# Altium project 基于单片机的电子秤.PrjPCB
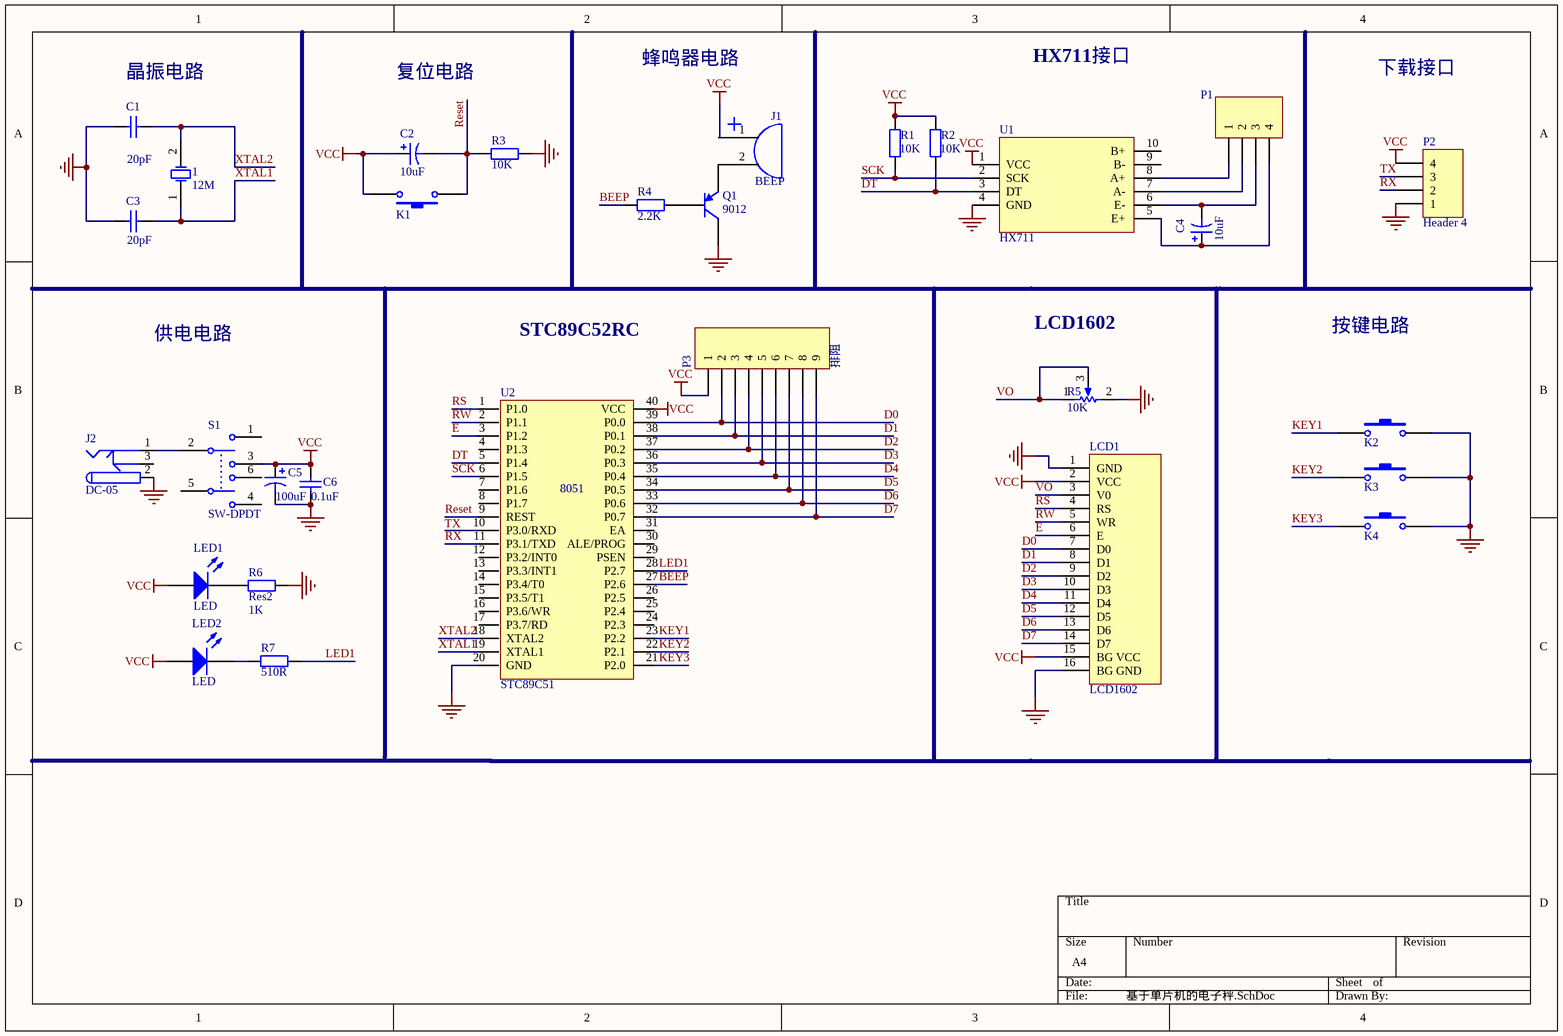
[diagram p0: 基于单片机的电子秤.SchDoc]
1 sheet, 30 parts. Net scope: global (net labels, ports and power ports of the same name join across sheets).
Board file: 基于单片机的电子秤.PcbDoc

## Sheet 基于单片机的电子秤.SchDoc
size A4

### Parts
1  12M  [XTAL_US]
C1  value 20pF  [RAD-0.1]  (hidden comment: Cap)
C2  value 10uF  [RB.1/.2]  (hidden comment: Cap Pol1)
C3  value 20pF  [RAD-0.1]  (hidden comment: Cap)
C4  value 10uF  [RB7.6-15]  (hidden comment: Cap Pol1)
C5  value 100uF  [RB.1/.2]  (hidden comment: Cap Pol1)
C6  value 0.1uF  [RAD-0.1]  (hidden comment: Cap)
J1  BEEP  [Beep]
J2  DC-05  [DC-05]
K1  四脚按键  [四脚按键]  (value not drawn)
K2  四脚按键  [四脚按键]  (value not drawn)
K3  四脚按键  [四脚按键]  (value not drawn)
K4  四脚按键  [四脚按键]  (value not drawn)
LCD1  LCD1602  [LCD1602]
LED1  LED  [LED]
LED2  LED  [LED]
P1  Header 4  [HDR4X1_B1]  (value not drawn)
P2  Header 4  [HDR1X4]
P3  排阻  [SIP9]
Q1  9012  [TO-92A]
R1  value 10K  [AXIAL-0.4]  (hidden comment: Res2)
R2  value 10K  [AXIAL-0.4]  (hidden comment: Res2)
R3  value 10K  [AXIAL-0.4]  (hidden comment: Res2)
R4  value 2.2K  [AXIAL-0.4]  (hidden comment: Res2)
R5  10K  [RPot]
R6  Res2  value 1K  [AXIAL-0.4]
R7  value 510R  [AXIAL-0.4]  (hidden comment: Res2)
S1  SW-DPDT  [SWITCH_B1]
U1  HX711  [HX711]
U2  STC89C51  [DIP-40]

### Nets
GND: C1.2 C3.2 C5.2 C6.1 J2.2 K2.1 K3.1 K4.1 LCD1.1(GND) LCD1.16(BG_GND) P2.1 Q1.3(C) R3.1 R5.2 R6.2 U1.4(GND) U2.20(GND)
VCC: C2.1 C5.1 C6.2 J1.1 K1.1 LCD1.2(VCC) LCD1.15(BG_VCC) LED1.1 LED2.1 P2.4 P3.1 R1.1 R2.1 S1.3 U1.1(VCC) U2.40(VCC)
BEEP: R4.2 U2.27(P2.6)
D0: LCD1.7(D0) P3.2 U2.39(P0.0)
D1: LCD1.8(D1) P3.3 U2.38(P0.1)
D2: LCD1.9(D2) P3.4 U2.37(P0.2)
D3: LCD1.10(D3) P3.5 U2.36(P0.3)
D4: LCD1.11(D4) P3.6 U2.35(P0.4)
D5: LCD1.12(D5) P3.7 U2.34(P0.5)
D6: LCD1.13(D6) P3.8 U2.33(P0.6)
D7: LCD1.14(D7) P3.9 U2.32(P0.7)
DT: R2.2 U1.3(DT) U2.5(P1.4)
E: LCD1.6(E) U2.3(P1.2)
KEY1: K2.2 U2.23(P2.2)
KEY2: K3.2 U2.22(P2.1)
KEY3: K4.2 U2.21(P2.0)
LED1: R7.1 U2.28(P2.7)
Reset: C2.2 K1.2 R3.2 U2.9(REST)
RS: LCD1.4(RS) U2.1(P1.0)
RW: LCD1.5(WR) U2.2(P1.1)
RX: P2.2 U2.11(P3.1/TXD)
SCK: R1.2 U1.2(SCK) U2.6(P1.5)
TX: P2.3
VO: LCD1.3(V0) R5.1 R5.3
XTAL1: 1.1(OSC1) C3.1 U2.19(XTAL1)
XTAL2: 1.2(OSC2) C1.1 U2.18(XTAL2)
NetC4_1: C4.1 P1.4 U1.5(E+)
NetC4_2: C4.2 P1.3 U1.6(E-)
NetJ1_2: J1.2 Q1.1(E)
NetJ2_1: J2.1 S1.2
NetLED1_2: LED1.2 R6.1
NetLED2_2: LED2.2 R7.2
NetP1_1: P1.1 U1.8(A+)
NetP1_2: P1.2 U1.7(A-)
NetQ1_2: Q1.2(B) R4.1

Not connected (* = marked no-connect by the designer): J2 3; S1 1 4 5 6; U1 9(B-) 10(B+); U2 4(P1.3) 7(P1.6) 8(P1.7) 10(P3.0/RXD) 12(P3.2/INT0) 13(P3.3/INT1) 14(P3.4/T0) 15(P3.5/T1) 16(P3.6/WR) 17(P3.7/RD) 24(P2.3) 25(P2.4) 26(P2.5) 29(PSEN) 30(ALE/PROG) 31(EA)

### Notes on the sheet
- (near C1) 晶振电路
- 复位电路
- 蜂鸣器电路
- HX711接口
- 下载接口
- 供电电路
- STC89C52RC
- (near R5) LCD1602
- 按键电路
- Labels drawn without touching a wire or pin: TX
- (in symbol STC89C51) 8051

### Library data of the parts
1 = XTAL: Crystal Oscillator; Published: 8-Jun-2000; LatestRevisionDate: 17-Jul-2002; LatestRevisionNote: Re-released for DXP Platform.; PackageReference: R38; Publisher: Altium Limited; PackageDescription: Crystal, Thru-Hole; 2 Leads; Body 3.1 x 8.2 mm (Dia.xH)
C1 C3 C6 = Cap: Capacitor; Published: 8-Jun-2000; LatestRevisionDate: 17-Jul-2002; LatestRevisionNote: Re-released for DXP Platform.; PackageReference: RAD-0.3; Publisher: Altium Limited; PackageDescription: Radial Cap, Thru-Hole; 2 Leads; 0.3 in Pin Spacing
C2 C4 C5 = Cap Pol1: Polarized Capacitor (Radial); Published: 8-Jun-2000; LatestRevisionDate: 17-Jul-2002; LatestRevisionNote: Re-released for DXP Platform.; PackageReference: RB7.6-15; Publisher: Altium Limited; PackageDescription: Polarized Capacitor (Radial); 2 Leads
J1 = BEEP: 蜂鸣器
P1 = Header 4: 接插件; LatestRevisionDate: 17-Jul-2002; LatestRevisionNote: Re-released for DXP Platform.; Publisher: Altium Limited
P2 = Header 4: Header, 4-Pin; LatestRevisionDate: 17-Jul-2002; LatestRevisionNote: Re-released for DXP Platform.; Publisher: Altium Limited
P3 = Header 9: Header, 9-Pin; LatestRevisionDate: 17-Jul-2002; LatestRevisionNote: Re-released for DXP Platform.; Publisher: Altium Limited
Q1 = 2N3906: PNP General Purpose Amplifier; Published: 8-Jun-2000; LatestRevisionDate: 15-Jan-2003; LatestRevisionNote: PCB Footprint 'BCY-W3/D4.7' replaced; DatasheetVersion: 1997; PackageVersion: Sep-1998; PackageReference: TO-92A; Publisher: Altium Limited; PackageDescription: TO, Flat Index; 3 In-Line, Axial Leads; Body Dia. 4.5mm; Leads 0.51 x 0.48 mm (max); ComponentLink1Description: Manufacturer Link; ComponentLink1URL: http://www.fairchildsemi.com/; ComponentLink2Description: Datasheet; ComponentLink2URL: http://www.fairchildsemi.com/ds/2N%2F2N3906.pdf
R1-R4 R6 R7 = Res2: Resistor; Published: 8-Jun-2000; LatestRevisionDate: 17-Jul-2002; LatestRevisionNote: Re-released for DXP Platform.; PackageReference: AXIAL-0.4; Publisher: Altium Limited; PackageDescription: Axial Device, Thru-Hole; 2 Leads; 0.4 in Pin Spacing
R5 = RPOT
S1 = SW-DPDT: 单刀双掷开关; Published: 24-Mar-1999; LatestRevisionDate: 17-Jul-2002; LatestRevisionNote: Re-released for DXP Platform.; PackageReference: DPDT-6; Publisher: Altium Limited